# EAGLE design BehaviorShield (EAGLE 9.2.2)
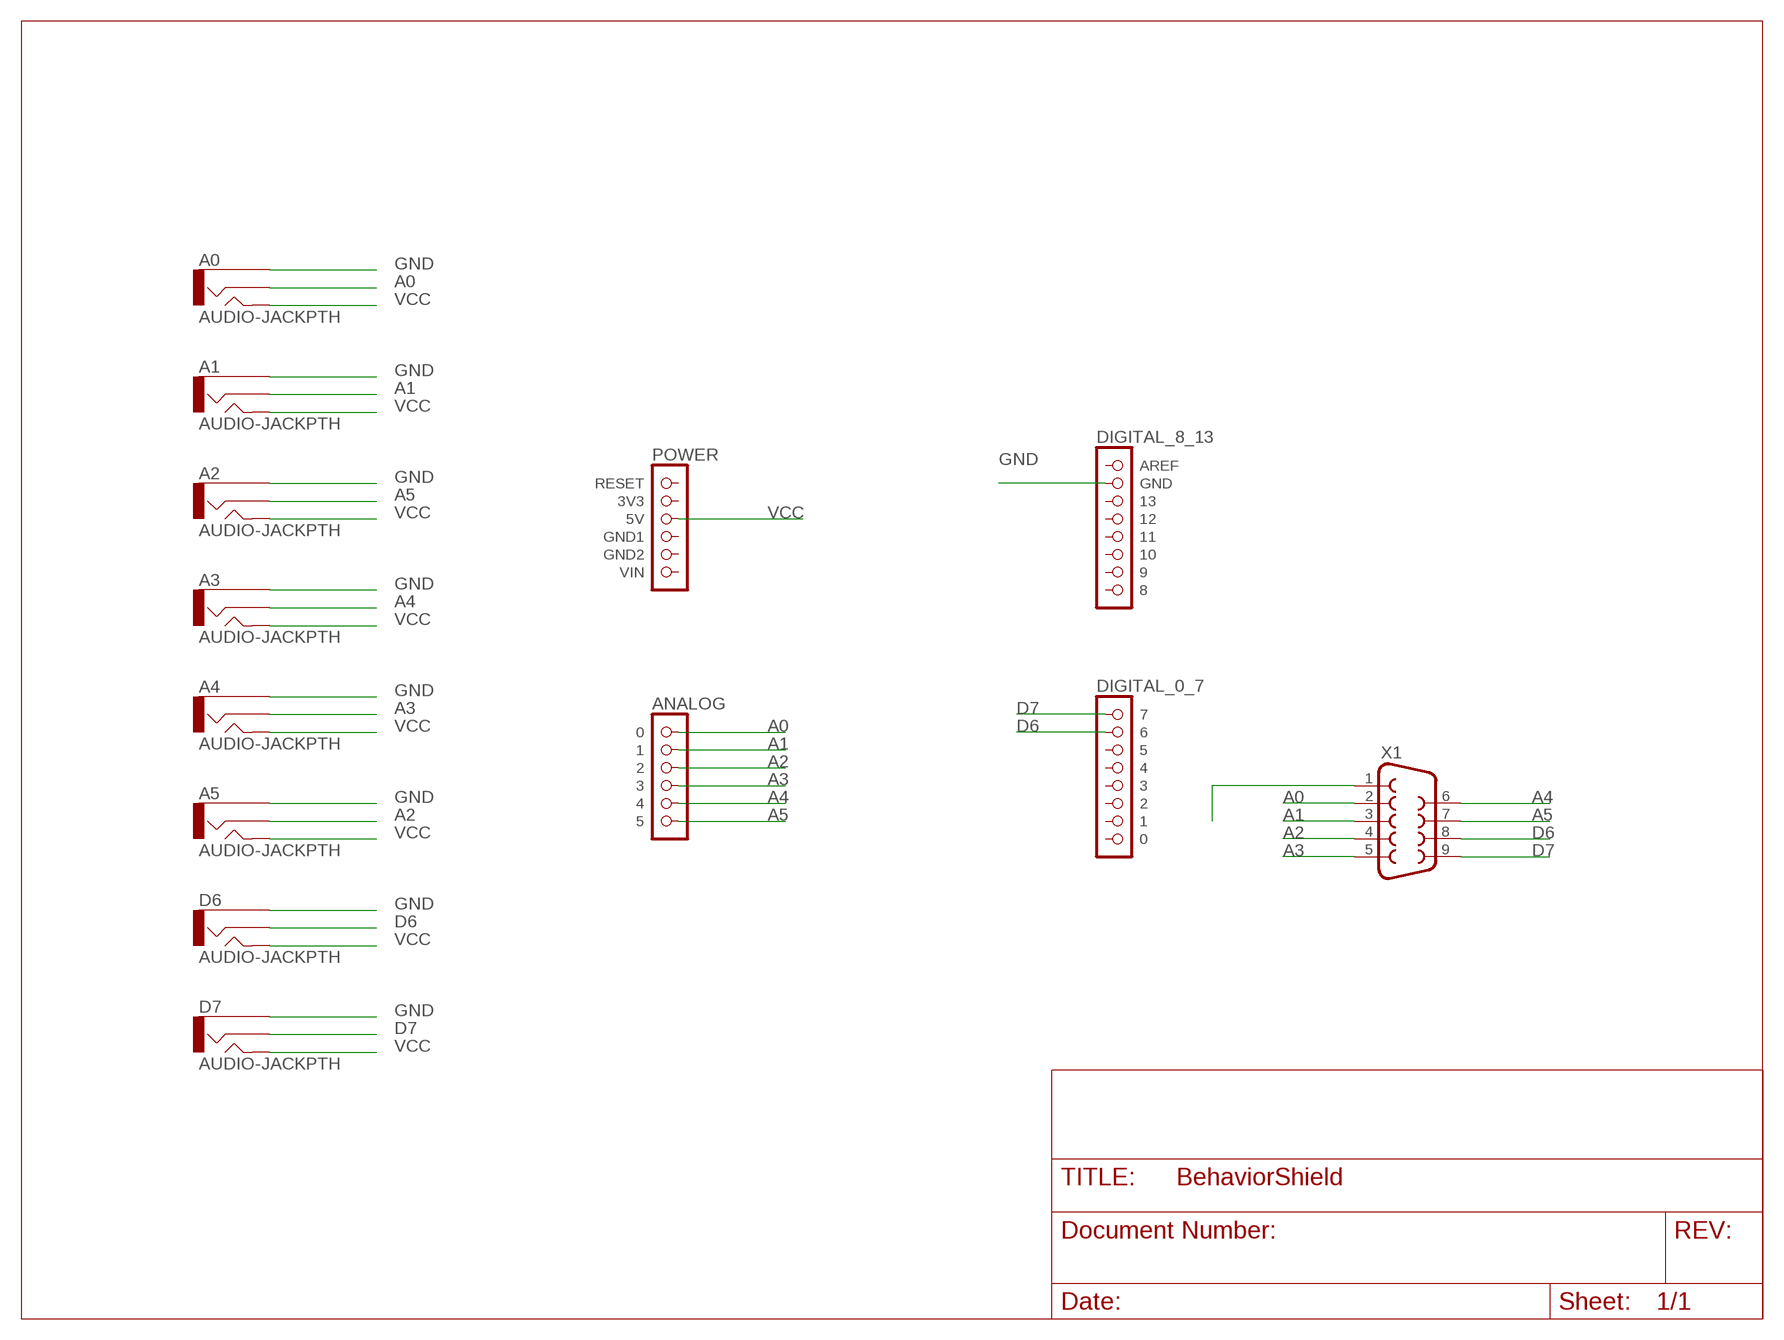
[diagram p0: schematic, sheet 1]

## Parts
A0  AUDIO-JACKPTH  [AUDIO-JACK]
A1  AUDIO-JACKPTH  [AUDIO-JACK]
A2  AUDIO-JACKPTH  [AUDIO-JACK]
A3  AUDIO-JACKPTH  [AUDIO-JACK]
A4  AUDIO-JACKPTH  [AUDIO-JACK]
A5  AUDIO-JACKPTH  [AUDIO-JACK]
D6  AUDIO-JACKPTH  [AUDIO-JACK]
D7  AUDIO-JACKPTH  [AUDIO-JACK]
U$1  POWER  [1X06]
U$2  ANALOG  [1X06]
U$3  DIGITAL_0_7  [1X08]
U$4  DIGITAL_8_13  [1X08]
X1  F09HP  [F09HP]

## Nets
A0: A0.2 U$2.1 X1.2
A1: A1.2 U$2.2 X1.3
A2: A5.2 U$2.3 X1.4
A3: A4.2 U$2.4 X1.5
A4: A3.2 U$2.5 X1.6
A5: A2.2 U$2.6 X1.7
D6: D6.2 U$3.2 X1.8
D7: D7.2 U$3.1 X1.9
GND: A0.1 A1.1 A2.1 A3.1 A4.1 A5.1 D6.1 D7.1 U$4.2(GND) X1.1
VCC: A0.5 A1.5 A2.5 A3.5 A4.5 A5.5 D6.5 D7.5 U$1.3(5V)
Unconnected: U$1.1(RESET) U$1.2(3V3) U$1.4(GND1) U$1.5(GND2) U$1.6(VIN) U$3.3 U$3.4 U$3.5 U$3.6 U$3.7 U$3.8 U$4.1(AREF) U$4.3 U$4.4 U$4.5 U$4.6 U$4.7 U$4.8

## Library data of the parts
A0 A1-A5 D6 D7 = SparkFun:AUDIO-JACK: 3.5mm Audio Jack Simple 3.5mm common PCB mount audio jack. SKU: PRT-08032
U$1 = arduino:POWER
U$2 = arduino:ANALOG
U$3 = arduino:DIGITAL_0_7
U$4 = arduino:DIGITAL_8_13
X1 = con-subd:F09: SUB-D; OC_FARNELL: unknown; OC_NEWARK: unknown

## Board
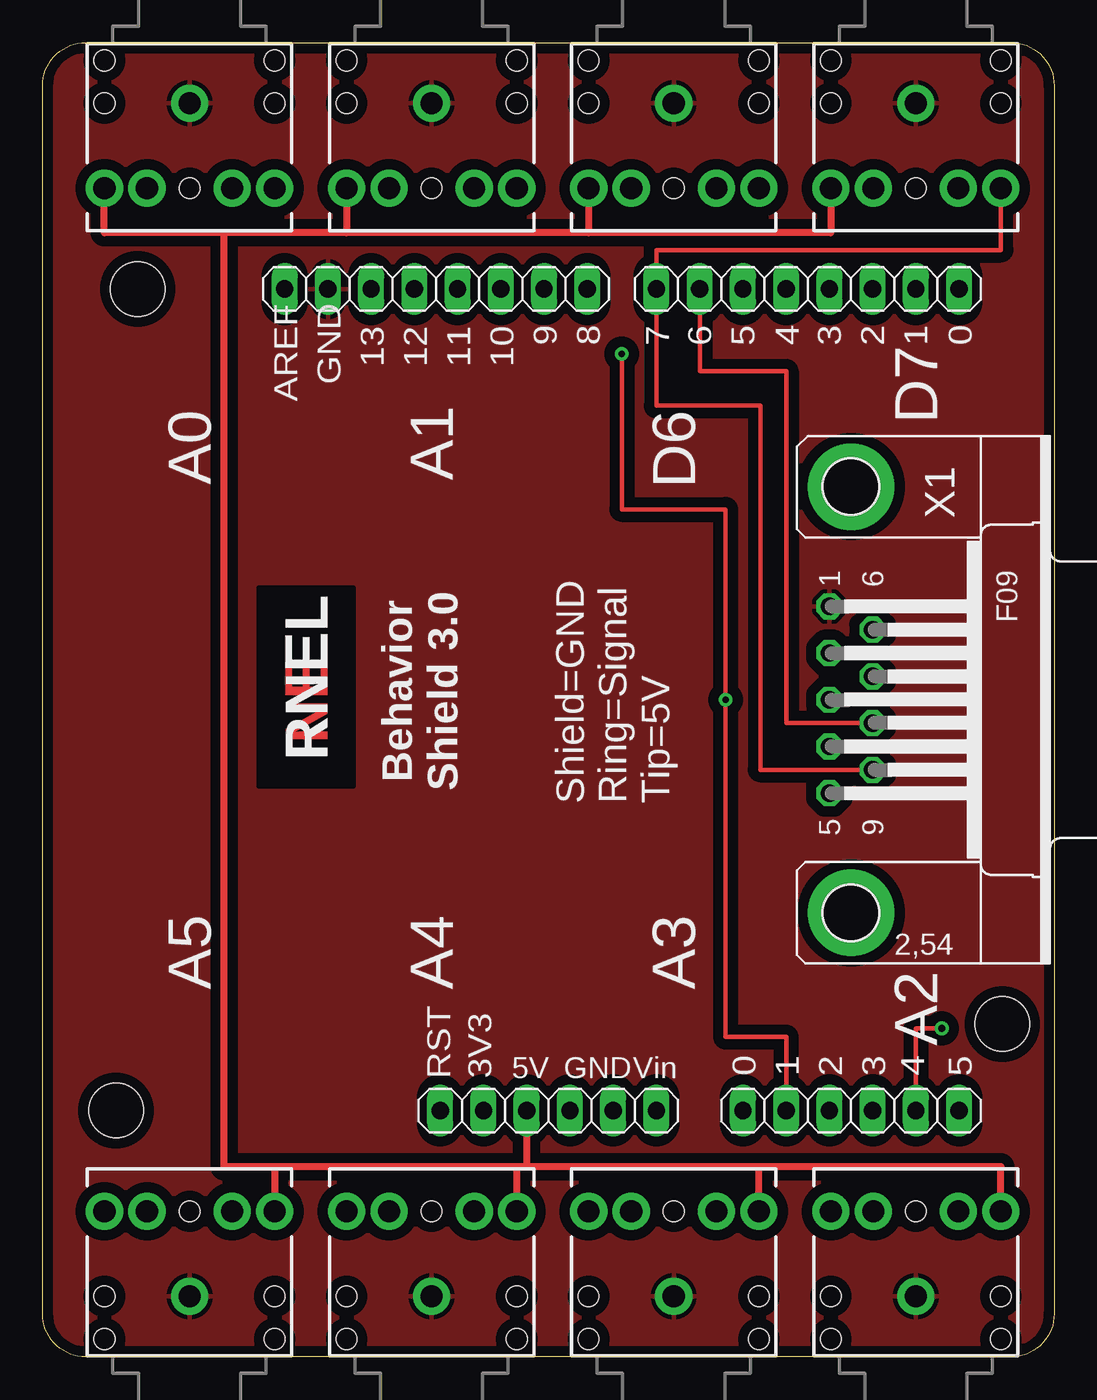
[diagram p1: board, top side]
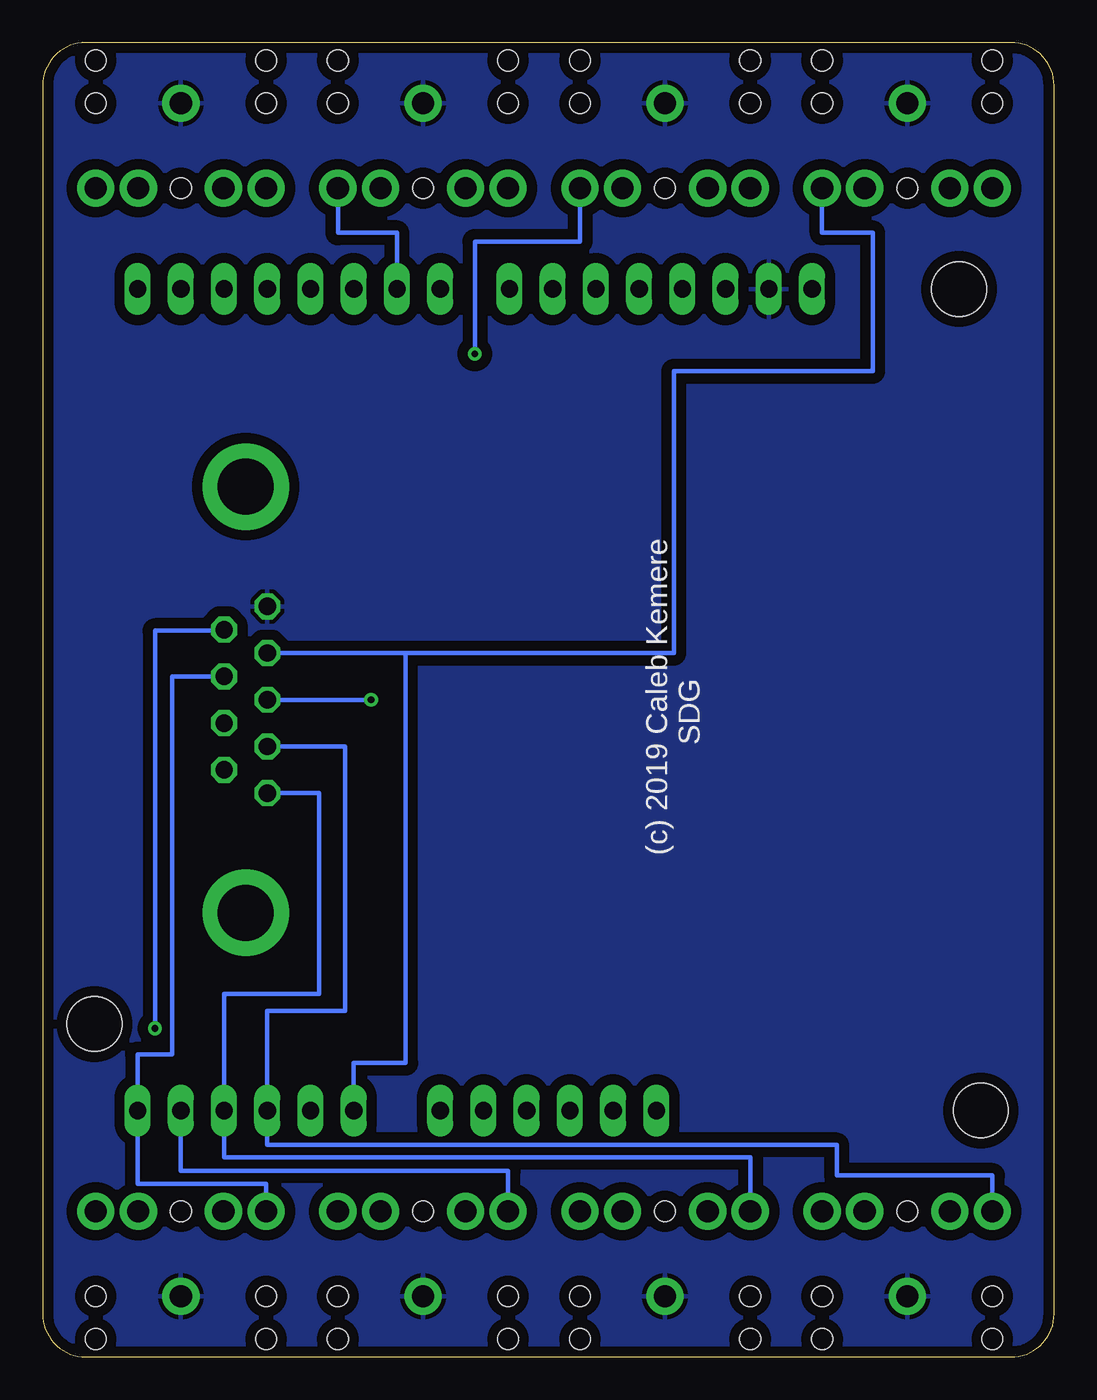
[diagram p2: board, bottom side, seen from below]

Size 59.44 x 77.22 mm. Coordinates in mm from the lower left corner, seen from the top.
Outline: 0,74.68 arc-90 2.54,77.22 56.9,77.22 arc-90 59.44,74.68 59.44,2.54 arc-90 56.9,0 2.54,0 arc-90 0,2.54 0,74.68
Copper layers (1*16): Top 0.035mm / dielectric 1.5mm / Bottom 0.035mm
Design rules "adafruit": minimum track width 8mil, minimum drill 15.5mil, track to track 8mil, track to pad 8mil, pad to pad 8mil, via to via 8mil, smd to smd 8mil, copper to edge 10mil, drill to drill 8mil, minimum pad ring 10mil, minimum via ring 8mil, stop-mask expansion 2mil, vias tented up to drill 20mil, thermal gap 10mil
Holes 3.2 mm at 4.32,14.48 5.59,62.74 56.39,19.56

### Footprints (pad centres in the part's own frame; a part is rotated, then mirrored left to right if it is on the bottom)
AUDIO-JACK = drill 1.3 pad 2.184: 1 0,0; 2 5,5; 3 5,2.5; 4 5,-2.5; 5 5,-5 | hole 1.2: 0,5; -2.5,5; -2.5,-5; 0,-5; 5,0
1X06 = drill 1.016 long: 1 -6.35,0; 2 -3.81,0; 3 -1.27,0; 4 1.27,0; 5 3.81,0; 6 6.35,0
1X08 = drill 1.016 long: 1 -8.89,0; 2 -6.35,0; 3 -3.81,0; 4 -1.27,0; 5 1.27,0; 6 3.81,0; 7 6.35,0; 8 8.89,0
F09HP = drill 1.016 octagon: 1 -5.486,-1.27; 2 -2.743,-1.27; 3 0,-1.27; 4 2.743,-1.27; 5 5.486,-1.27; 6 -4.115,1.27; 7 -1.372,1.27; 8 1.372,1.27; 9 4.115,1.27 | drill 3.302 pad 5.08: G1 -12.522,0; G2 12.522,0

### Placement (x,y rotation side)
A0  8.64,73.66 270 top
A1  22.86,73.66 270 top
A2  51.31,3.56 90 top
A3  37.08,3.56 90 top
A4  22.86,3.56 90 top
A5  8.64,3.56 90 top
D6  37.08,73.66 270 top
D7  51.31,73.66 270 top
U$1  29.72,14.48 0 top
U$2  47.5,14.48 0 top
U$3  44.96,62.74 0 top
U$4  23.11,62.74 0 top
X1  47.5,38.61 270 top

### Tracks (layer width: path | path; a pad name or v marks a point on that pad's centre or on a via)
A0
  Bottom 0.254: U$2.1 41.15,17.27 38.1,17.27 38.1,41.35 | A0.2 13.64,66.04 10.67,66.04 10.67,57.91 22.35,57.91 22.35,41.35 38.1,41.35 | X1.2 38.1,41.35
A1  (via drill 0.39)
  Top 0.254: U$2.2 43.69,18.8 40.13,18.8 v40.13,38.61 40.13,49.78 34.04,49.78 v34.04,58.93
  Bottom 0.254: A1.2 27.86,65.53 34.04,65.53 v34.04,58.93 | X1.3 v40.13,38.61
A2
  Bottom 0.254: X1.4 41.66,35.87 41.66,20.32 46.23,20.32 U$2.3 46.23,12.45 12.78,12.45 12.78,10.67 3.64,10.67 A5.2
A3
  Bottom 0.254: A4.2 17.86,11.73 48.77,11.73 U$2.4 48.77,21.34 43.18,21.34 43.18,33.12 X1.5
A4  (via drill 0.39)
  Top 0.254: v52.83,19.3 51.31,19.3 U$2.5
  Bottom 0.254: U$2.5 51.31,10.92 32.08,10.92 A3.2 | X1.6 48.77,42.67 52.83,42.67 v52.83,19.3
A5
  Bottom 0.254: A2.2 46.31,10.16 53.85,10.16 U$2.6 53.85,17.78 51.82,17.78 51.82,39.98 X1.7
D6
  Top 0.254: U$3.2 38.61,57.91 43.69,57.91 43.69,37.24 X1.8
  Bottom 0.254: U$3.2 38.61,66.04 42.08,66.04 D6.2
D7
  Top 0.254: D7.2 56.31,65.02 36.07,65.02 U$3.1 36.07,55.88 42.16,55.88 42.16,34.49 X1.9
GND
  pour Bottom (isolate 0.61): 0,0 0,77.22 59.44,77.22 59.44,0
  pour Top (isolate 0.61, rank 4): 0,0 0,77.22 59.44,77.22 59.44,0
N$1
  cutout Top (rank 2): 12.7,45.21 12.7,33.53 18.29,33.53 18.29,45.21
VCC
  Top 0.406: 42.08,11.18 56.31,11.18 A2.5 | 42.08,11.18 28.45,11.18 | U$1.3 28.45,11.18 | 27.86,11.18 13.64,11.18 | 13.64,11.18 A5.5 | 28.45,11.18 27.86,11.18 | 27.86,11.18 A4.5 | A3.5 42.08,11.18 | A0.5 3.64,66.04 10.67,66.04 | 32.08,66.04 46.31,66.04 D7.5 | 32.08,66.04 17.86,66.04 | 17.86,66.04 10.67,66.04 | A1.5 17.86,66.04 | D6.5 32.08,66.04 | 13.64,11.18 10.67,11.18 10.67,66.04

### Text on the board
Top: NE
tPlace: Behavior / Shield 3.0 | Shield=GND / Ring=Signal / Tip=5V
tNames: 9 | 8 | 7 | 6 | 5 | 4 | 3 | 2 | 1 | 0 | 13 | 12 | 11 | 10 | GND | AREF | RNEL | 0 | 1 | 2 | 3 | 4 | 5 | RST | 3V3 | 5V | GND | Vin
bNames: (c) 2019 Caleb Kemere / SDG
tStop: NE